# EAGLE schematic schematic_atmega328_standalone_8MHz_LCD16x2 (EAGLE 9.6.2)
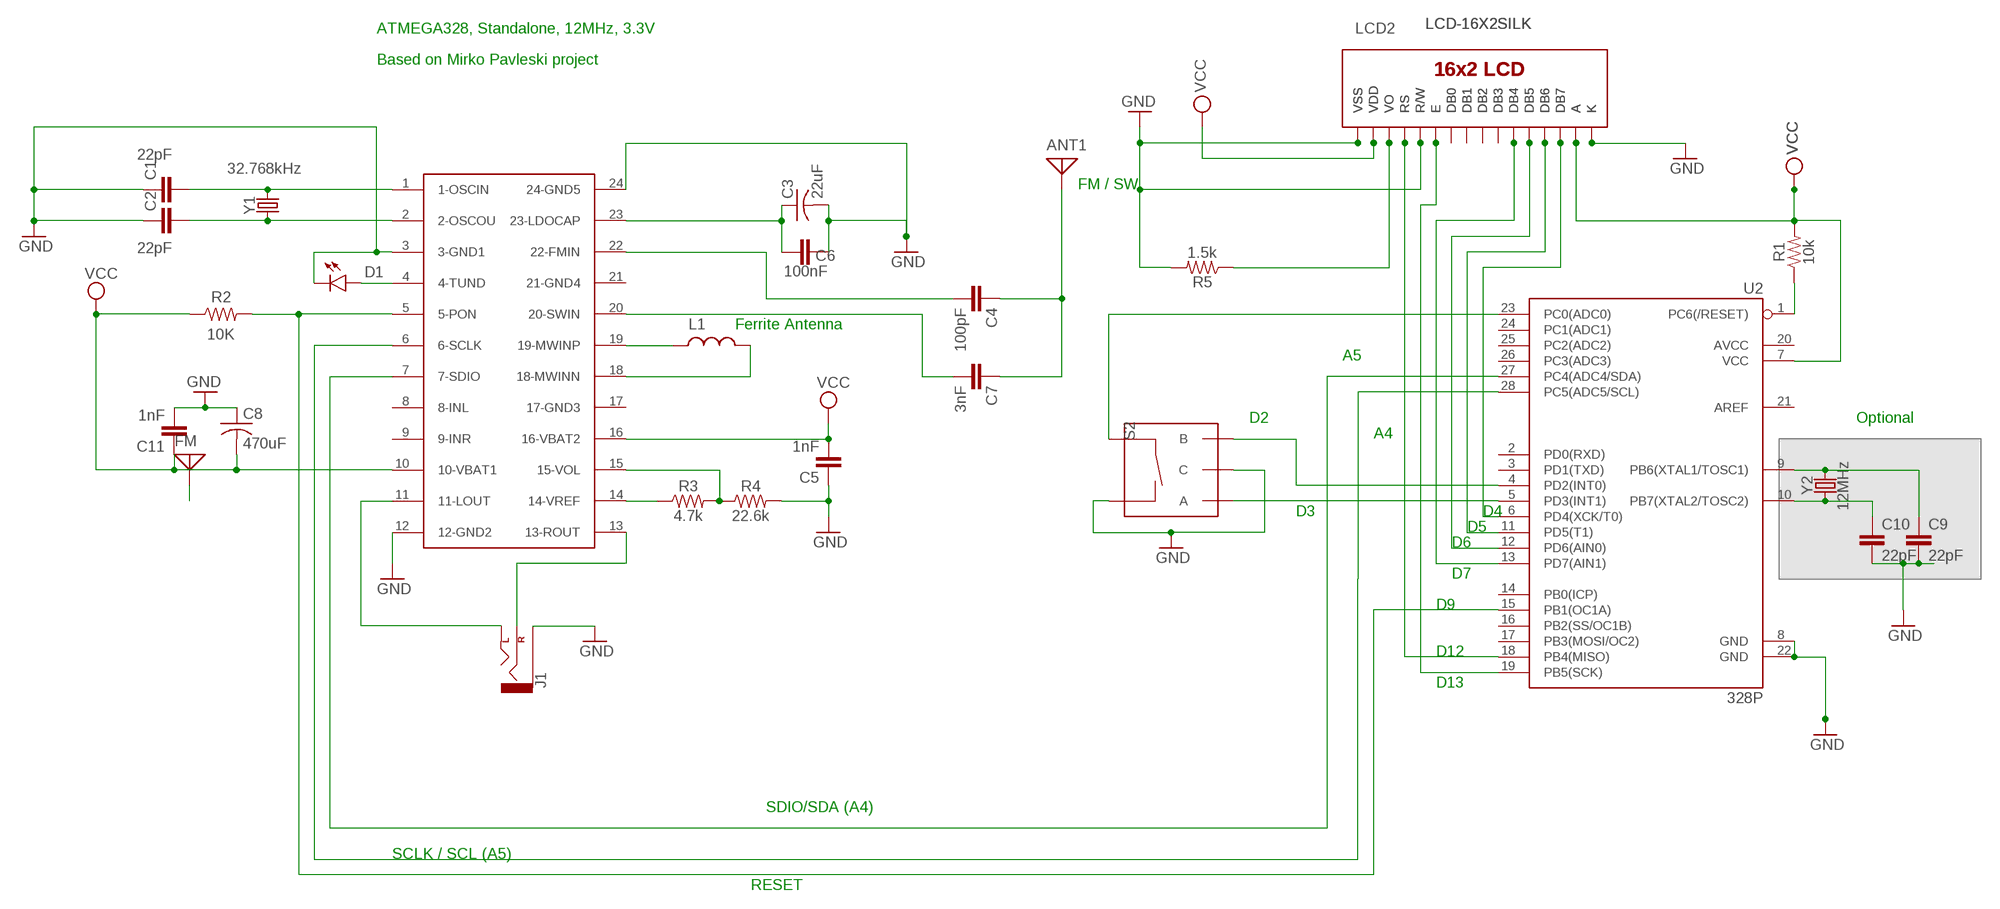
[diagram p0: schematic, sheet 1]

## Parts
ANT1  ANTENNA  [PAD-01]
C1  22pF  22PF-PTH-2.54MM-200V-5%  [CAP-PTH-2.54]
C2  22pF  22PF-PTH-2.54MM-200V-5%  [CAP-PTH-2.54]
C3  22uF  C-US025-024X044  [C025-024X044]
C4  100pF  C2,5-3  [C2.5-3]
C5  1nF  C2,5-3  [C2.5-3]
C6  100nF  C2,5-3  [C2.5-3]
C7  3nF  C2,5-3  [C2.5-3]
C8  470uF  C-US025-024X044  [C025-024X044]
C9  22pF  22PF-0603-50V-5%  [0603]
C10  22pF  22PF-0603-50V-5%  [0603]
C11  1nF  C2,5-3  [C2.5-3]
D1  LED5MM  [LED_5MM]
FM  ANTENNA  [PAD-01]
J1  AUDIO_JACK_2.5MMSPECIAL_POGO_PINS  [STEREOJACK2.5MM_SPECIAL_POGOPINS]
L1  L  (no package)
LCD1  LCD-16X2SILK  [LCD-16X2]
LCD2  LCD-16X2SILK  [LCD-16X2]
R1  10k  10KOHM-0603-1/10W-1%  [0603]
R2  10K  R-US_AXIAL-7.2MM-PITCH  [RESAD724W46L381D178B]
R3  4.7k  4.7KOHM-0603-1/10W-1%  [0603]
R4  22.6k  22.6KOHM-0603-1/10W-1%  [0603]
R5  1.5k  1.5KOHM-0603-1/10W-1%  [0603]
S2  ENCODER-SWITCH  [ROTARY_ENC_PLAIN]
U2  328P  ATMEGA328P_PDIP  [DIP28]
U$1  AKC6955AKC6955  [SOIC127P1032X265-24N]
Y1  32.768kHz  CRYSTAL-32.768kHzPTH-2X6  [CRYSTAL-PTH-2X6-CYL]
Y2  12MHz  CRYSTAL-12MHZ"  [CRYSTAL-SMD-5X3.2-4PAD]

## Nets
GND: C1.1 C2.1 C3.2 C5.1 C6.1 C8.1 C9.2 C10.2 C11.2 D1.K(C) J1.RING1(SLEEVE) LCD1.1(VSS) LCD1.5(R/W) LCD1.16(K) LCD2.1(VSS) LCD2.5(R/W) LCD2.16(K) R4.2 R5.2 S2.C S2.SW- U2.8(GND) U2.22(GND) U$1.3(3-GND1) U$1.12(12-GND2) U$1.24(24-GND5)
N$1: R1.1 U2.1(PC6(/RESET))
N$3: U2.27(PC4(ADC4/SDA)) U$1.7(7-SDIO)
N$5: C1.2 U$1.1(1-OSCIN) Y1.2
N$6: C2.2 U$1.2(2-OSCOU) Y1.1
N$7: D1.A U$1.4(4-TUND)
N$8: J1.SHIELD(LEFT) U$1.11(11-LOUT)
N$9: J1.TIP(RIGHT) U$1.13(13-ROUT)
N$10: R3.1 U$1.14(14-VREF)
N$11: R3.2 R4.1 U$1.15(15-VOL)
N$12: C3.1 C6.2 U$1.23(23-LDOCAP)
N$13: C4.2 U$1.22(22-FMIN)
N$14: FM.1
N$15: U2.28(PC5(ADC5/SCL)) U$1.6(6-SCLK)
N$16: C9.1 U2.9(PB6(XTAL1/TOSC1)) Y2.3
N$17: C10.1 U2.10(PB7(XTAL2/TOSC2)) Y2.1
N$18: ANT1.1 C4.1 C7.1
N$19: LCD1.14(DB7) LCD2.14(DB7) U2.6(PD4(XCK/T0))
N$20: R2.2 U2.15(PB1(OC1A)) U$1.5(5-PON)
N$21: LCD1.13(DB6) LCD2.13(DB6) U2.11(PD5(T1))
N$22: LCD1.12(DB5) LCD2.12(DB5) U2.12(PD6(AIN0))
N$23: LCD1.11(DB4) LCD2.11(DB4) U2.13(PD7(AIN1))
N$24: S2.B U2.4(PD2(INT0))
N$25: LCD1.7(DB0) LCD2.7(DB0)
N$26: LCD1.8(DB1) LCD2.8(DB1)
N$27: LCD1.9(DB2) LCD2.9(DB2)
N$28: LCD1.10(DB3) LCD2.10(DB3)
N$29: LCD1.6(E) LCD2.6(E) U2.19(PB5(SCK))
N$30: C7.2 U$1.20(20-SWIN)
N$31: S2.SW+ U2.23(PC0(ADC0))
N$32: LCD1.4(RS) LCD2.4(RS) U2.18(PB4(MISO))
N$33: S2.A U2.5(PD3(INT1))
N$34: LCD1.3(VO) LCD2.3(VO) R5.1
N$35: L1.2 U$1.18(18-MWINN)
N$36: L1.1 U$1.19(19-MWINP)
VCC: C5.2 C8.2 C11.1 LCD1.2(VDD) LCD1.15(A) LCD2.2(VDD) LCD2.15(A) R1.2 R2.1 U2.7(VCC) U$1.10(10-VBAT1) U$1.16(16-VBAT2)
Unconnected: U2.2(PD0(RXD)) U2.3(PD1(TXD)) U2.14(PB0(ICP)) U2.16(PB2(SS/OC1B)) U2.17(PB3(MOSI/OC2)) U2.20(AVCC) U2.21(AREF) U2.24(PC1(ADC1)) U2.25(PC2(ADC2)) U2.26(PC3(ADC3)) U$1.8(8-INL) U$1.9(9-INR) U$1.17(17-GND3) U$1.21(21-GND4)

## Notes on the sheet
- ATMEGA328, Standalone, 12MHz, 3.3V
- Based on Mirko Pavleski project
- FM / SW
- Ferrite Antenna
- A5
- D2 | Optional
- A4
- D3 | D4
- D5
- D6
- D7
- D9
- D12
- D13
- SDIO/SDA (A4)
- SCLK / SCL (A5)
- RESET

## Library data of the parts
ANT1 FM = discrete:ANTENNA: Antenna
C1 C2 = SparkFun-Capacitors:22PF: 22pF ceramic capacitors A capacitor is a passive two-terminal electrical component used to store electrical energy temporarily in an electric field.; PROD_ID: CAP-09128
C3 C8 = adafruit:C-US: CAPACITOR, American symbol
C4-C7 C11 = capacitor-wima:C: CAPACITOR naming: grid - package width
C9 C10 = SparkFun-Capacitors:22PF: 22pF ceramic capacitors A capacitor is a passive two-terminal electrical component used to store electrical energy temporarily in an electric field.; PROD_ID: CAP-07876
D1 = SparkFun-LED:LED: LED (Generic) Standard schematic elements and footprints for 5mm, 3mm, 1206, and 0603 sized LEDs. Generic LEDs with no color specified.
J1 = SparkFun-Connectors:AUDIO_JACK_2.5MM: Audio Jack 2.5mm variants of PTH and SMT audio jacks. SparkFun Products: SparkFun PicoBoard <https://www.sparkfun.com/products/11888>- 2.5mm SMD
L1 = ngspice-simulation:L: INDUCTOR
LCD1 LCD2 = SparkFun-Displays:LCD-16X2: Standard text-only 16x2 parallel input LCD Basic 16 character by 2 line display. Typically utilizes the extremely common HD44780 parallel interface chipset SparkFun Products: Basic 16x2 Green <https://www.sparkfun.com/products/255> Basic 8x2 Green <https://www.sparkfun.com/products/11122>; SF_ID: LCD-00255
R1 = SparkFun-Resistors:10KOHM: 10kΩ resistor A resistor is a passive two-terminal electrical component that implements electrical resistance as a circuit element. Resistors act to reduce current flow, and, at the same time, act to lower voltage levels within circuits. - Wikipedia; PROD_ID: RES-00824
R2 = Resistor:R-US: Resistor Fixed - ANSI; CATEGORY: Resistor; SUB-CATEGORY: Fixed
R3 = SparkFun-Resistors:4.7KOHM: 4.7kΩ resistor A resistor is a passive two-terminal electrical component that implements electrical resistance as a circuit element. Resistors act to reduce current flow, and, at the same time, act to lower voltage levels within circuits. - Wikipedia; PROD_ID: RES-07857
R4 = SparkFun-Resistors:22.6KOHM: 22.6kΩ resistor A resistor is a passive two-terminal electrical component that implements electrical resistance as a circuit element. Resistors act to reduce current flow, and, at the same time, act to lower voltage levels within circuits. - Wikipedia; PROD_ID: RES-09384
R5 = SparkFun-Resistors:1.5KOHM: 1.5kΩ resistor A resistor is a passive two-terminal electrical component that implements electrical resistance as a circuit element. Resistors act to reduce current flow, and, at the same time, act to lower voltage levels within circuits. - Wikipedia; PROD_ID: RES-08306
S2 = SparkFun-Switches:ENCODER-SWITCH: Rotary Encoder w/ Select Switch Encoders rotate similarly to potentiometers, but they’re different from potentiometers in that an encoder has full rotation without limits. They output gray code so that you can tell how much and in which direction the encoder has been turned. This encoder includes a push-down select switch built into the shaft. SparkFun Products Rotary Encoder <https://www.sparkfun.com/products/9117> (COM-09117); SF_SKU: COM-09117
U2 = SparkFun-IC-Microcontroller:ATMEGA328P_PDIP: Atmel 328P Through hole ATMEGA328P uC used in the Arduino 32kb flash, 1k EEPROM, 2k SRAM Datasheet <http://www.sparkfun.com/datasheets/Components/SMD/ATMega328.pdf> SparkFun Products Storefront component: AVR 28 Pin 20MHz 32K 6A/D - ATMega328P <https://www.sparkfun.com/products/9061> (COM-09061) SparkFun Simon Says - Through-Hole Soldering Kit <https://www.sparkfun.com/products/10547> (KIT-10547) SparkFun Learn to Solder - Simon Says <https://www.sparkfun.com/products/13708> (KIT-13708) SparkFun BigTime Watch Kit <https://www.sparkfun.com/products/11734> (KIT-11734) SparkFun ClockIt <https://www.sparkfun.com/products/10930> (KIT-10930) SparkFun Serial Enabled LCD Kit <https://www.sparkfun.com/products/10097> (LCD-10097) SparkFun Simon Tilts - Through Hole Soldering Kit <https://www.sparkfun.com/products/12634> (KIT-12634) SparkFun Frequency Counter Kit <https://www.sparkfun.com/products/10140> (KIT-10140) FabFM Radio Kit <https://www.sparkfun.com/products/11043> (KIT-11043) SparkFun Binary Blaster Kit <https://www.sparkfun.com/products/12037> (KIT-12037) SparkFun Metro-Gnome <https://www.sparkfun.com/products/9236> (KIT-09236) ATmega328 with Arduino Optiboot (Uno) <https://www.sparkfun.com/products/10524> (DEV-10524); PROD_ID: IC-09136
U$1 = AKC:AKC6955
Y1 = SparkFun-Clocks:CRYSTAL-32.768kHz: 32.768kHz Crystal Frequency: 32.768kHz Frequency Stability: ±20ppm Load Capacitance: 12.5pF (PTH-2X6 & SMD-3.2X1.5), 6pF (SMD-2X6) SparkFun Products: SparkFun BigTime Watch Kit <https://www.sparkfun.com/products/11734> SparkFun nRF52832 Breakout <https://www.sparkfun.com/products/13990> SparkFun Real Time Clock Module <https://www.sparkfun.com/products/12708>; PROD_ID: XTAL-10112
Y2 = SparkFun-Clocks:CRYSTAL-12MHZ: 12.0MHz Crystal Frequency: 12.0MHz Frequency Tolerance: ±20ppm Load Capacitance: 18pF SparkFun Products: SparkFun Logomatic <https://www.sparkfun.com/products/12772> Pocket AVR Programmer <https://www.sparkfun.com/products/9825>; PROD_ID: XTAL-08297